# EAGLE design template (EAGLE 7.7.0)
DRAWING_NUMBER: V001; DRAWN: Mario Blunk / Blunk electronic; PROJECT: agile HW demo; STATUS: development

## Sheet 1 of 2
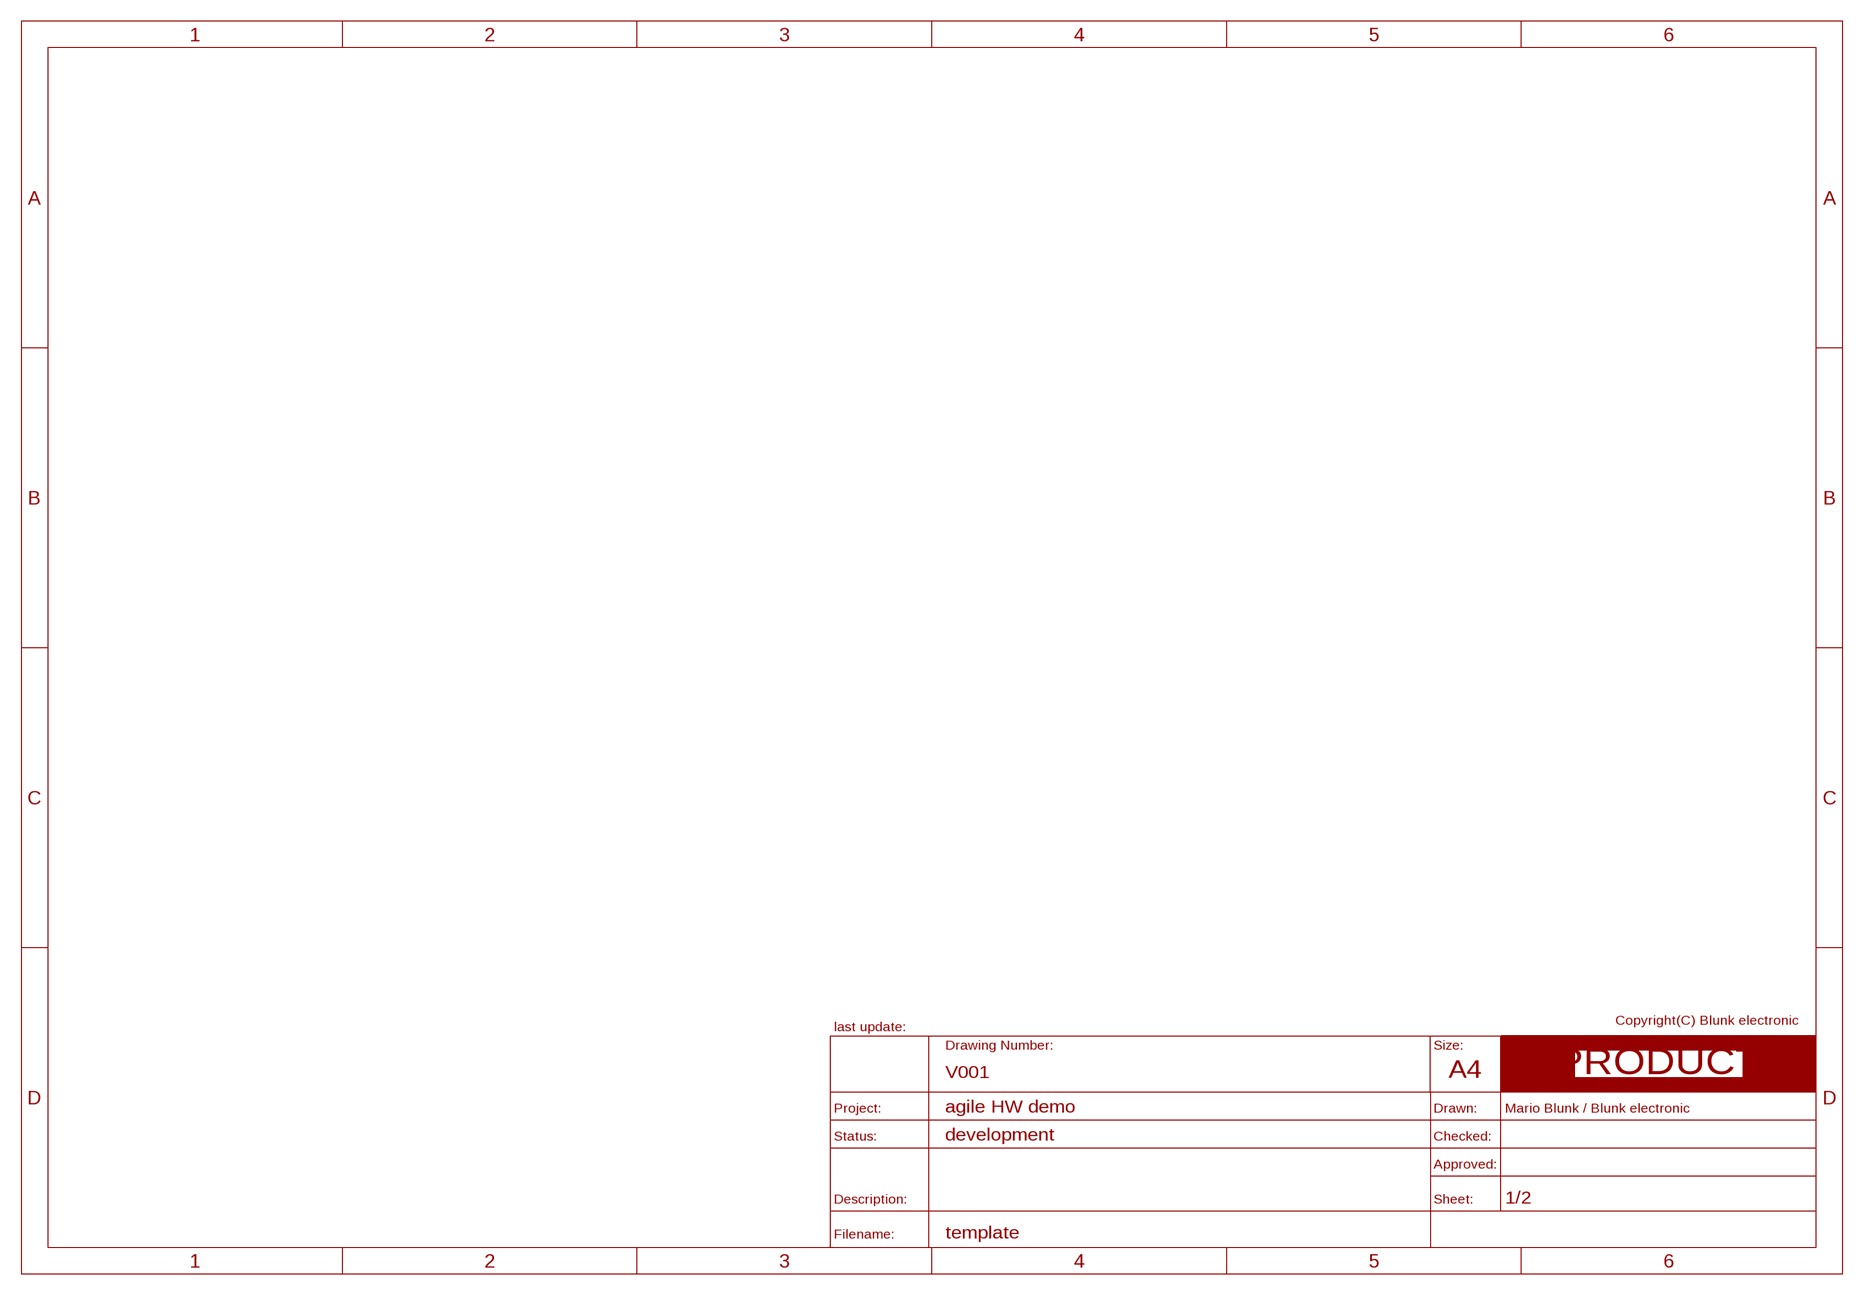
[diagram p0: schematic, sheet 1]
FRAME_PRODUCT1 (A4_LANDSCAPE_PRODUCT): BOM: NO; COMMISSIONED: 2013-08-30

## Sheet 2 of 2
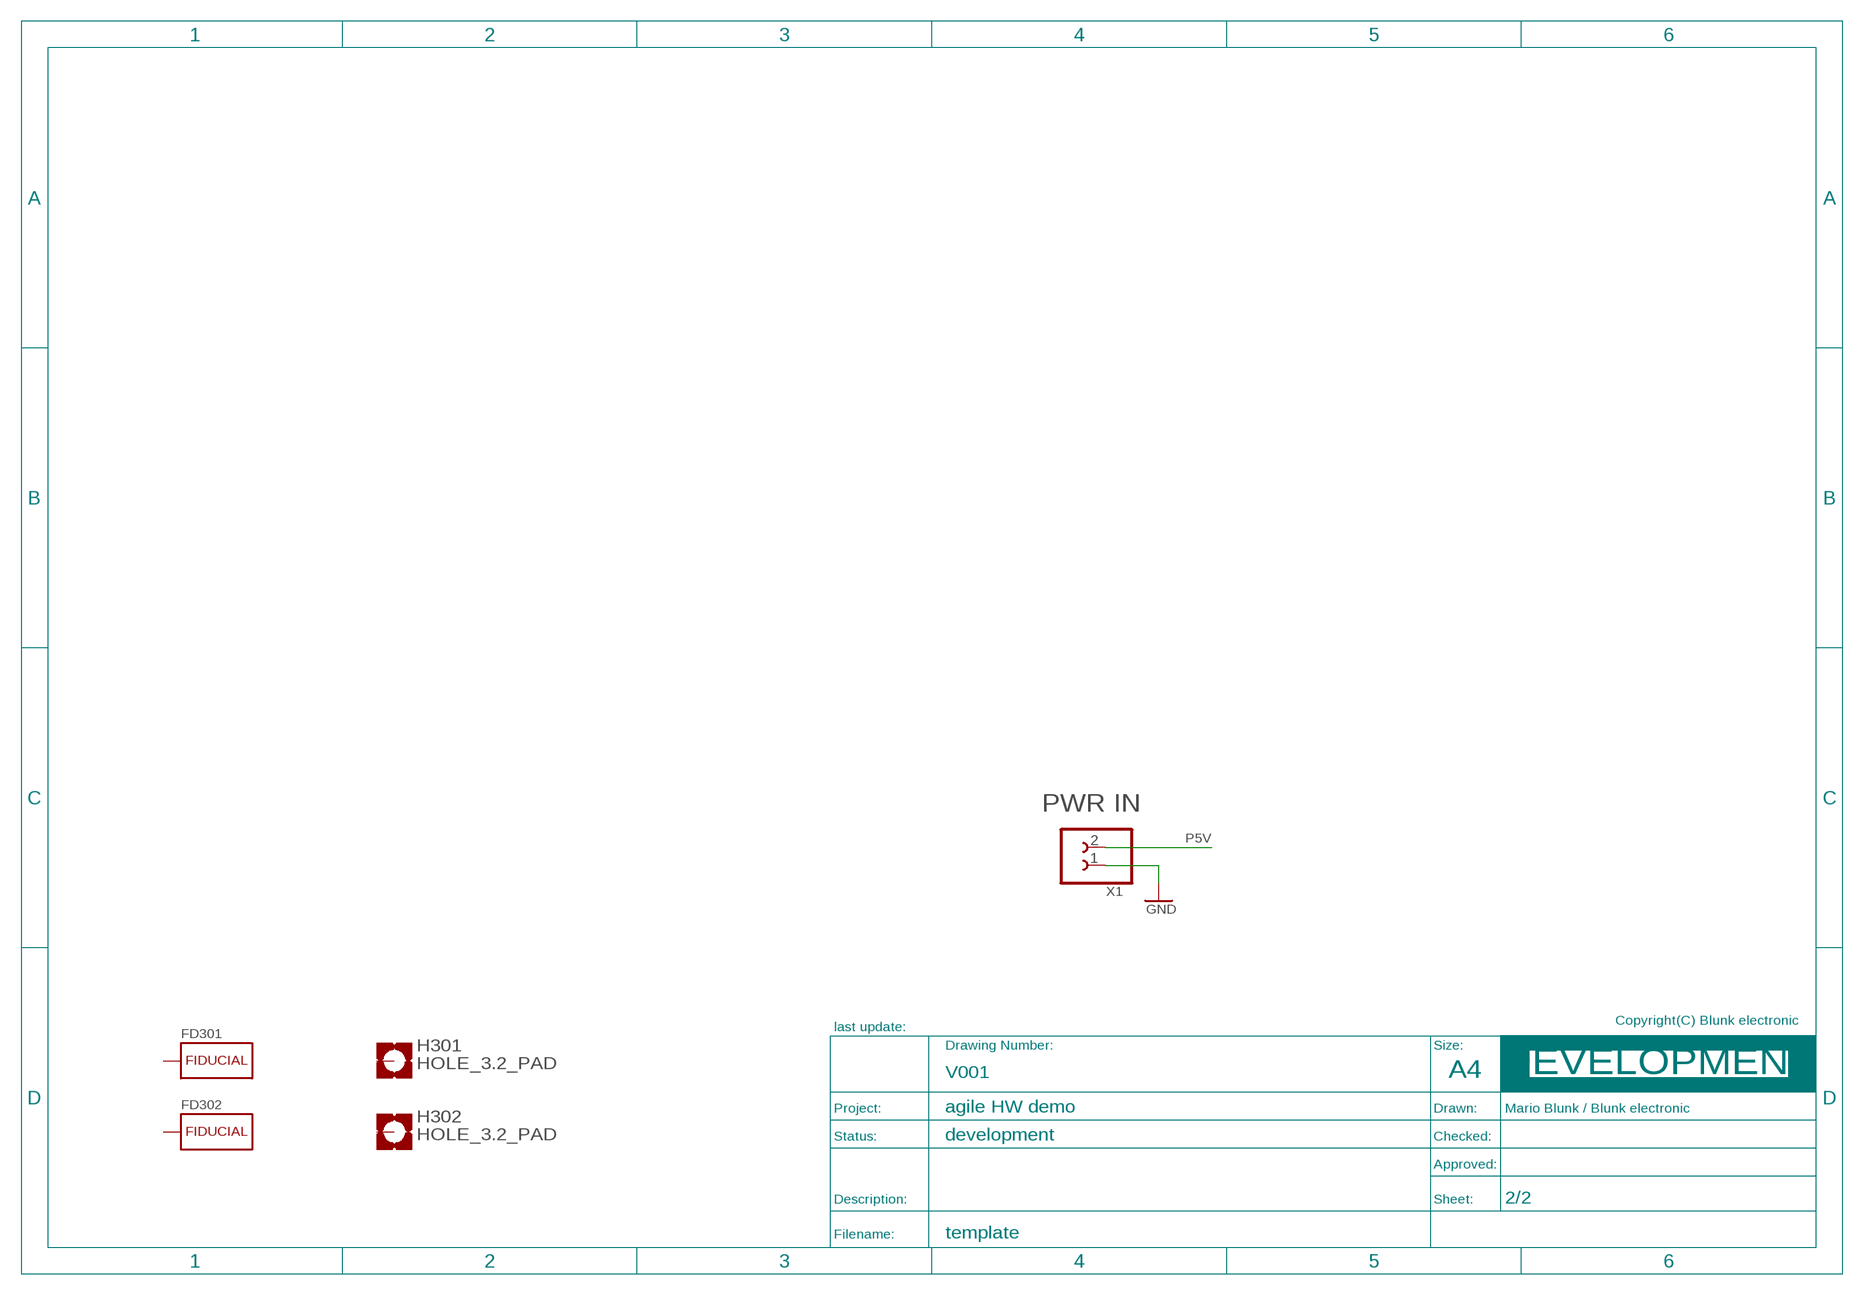
[diagram p1: schematic, sheet 2]
FRAME_DEVELOPMENT1 (A4_LANDSCAPE_DEVELOPMENT): BOM: NO; COMMISSIONED: 2013-08-30

### Parts
FD301  FIDUCIAL_CROSSHAIR  [CROSSHAIR]
FD302  FIDUCIAL_CROSSHAIR  [CROSSHAIR]
H301  HOLE_3.2_PAD  [3.2_PAD]
H302  HOLE_3.2_PAD  [3.2_PAD]
X1  CLAMP_1X2-T-2.5MM  [T_WIRE_CLAMP_1X2_PITCH_2MM5]

### Nets
GND: X1.1
P5V: X1.2
Unconnected: FD301.1(NC) FD302.1(NC) H301.H1(MOUNT) H302.H1(MOUNT)

## Library data of the parts
FD301 FD302 = be_marks:FIDUCIAL: drawn: Mario Blunk / Blunk electronic; BOM: NO; COMMISSIONED: 2013-12-03
H301 H302 = be_holes:HOLE: edited: Mario Blunk; BOM: NO; COMMISSIONED: 2015-01-15
X1 = be_con_jump:CLAMP_1X2: drawn: Mario Blunk / Blunk electronic; BOM: YES; COMMISSIONED: 2014-04-14; FUNCTION: PWR IN; PART_CODE_BEL: X_PAC_T_CLAMP_1X2_PITCH_2mm5

## Board
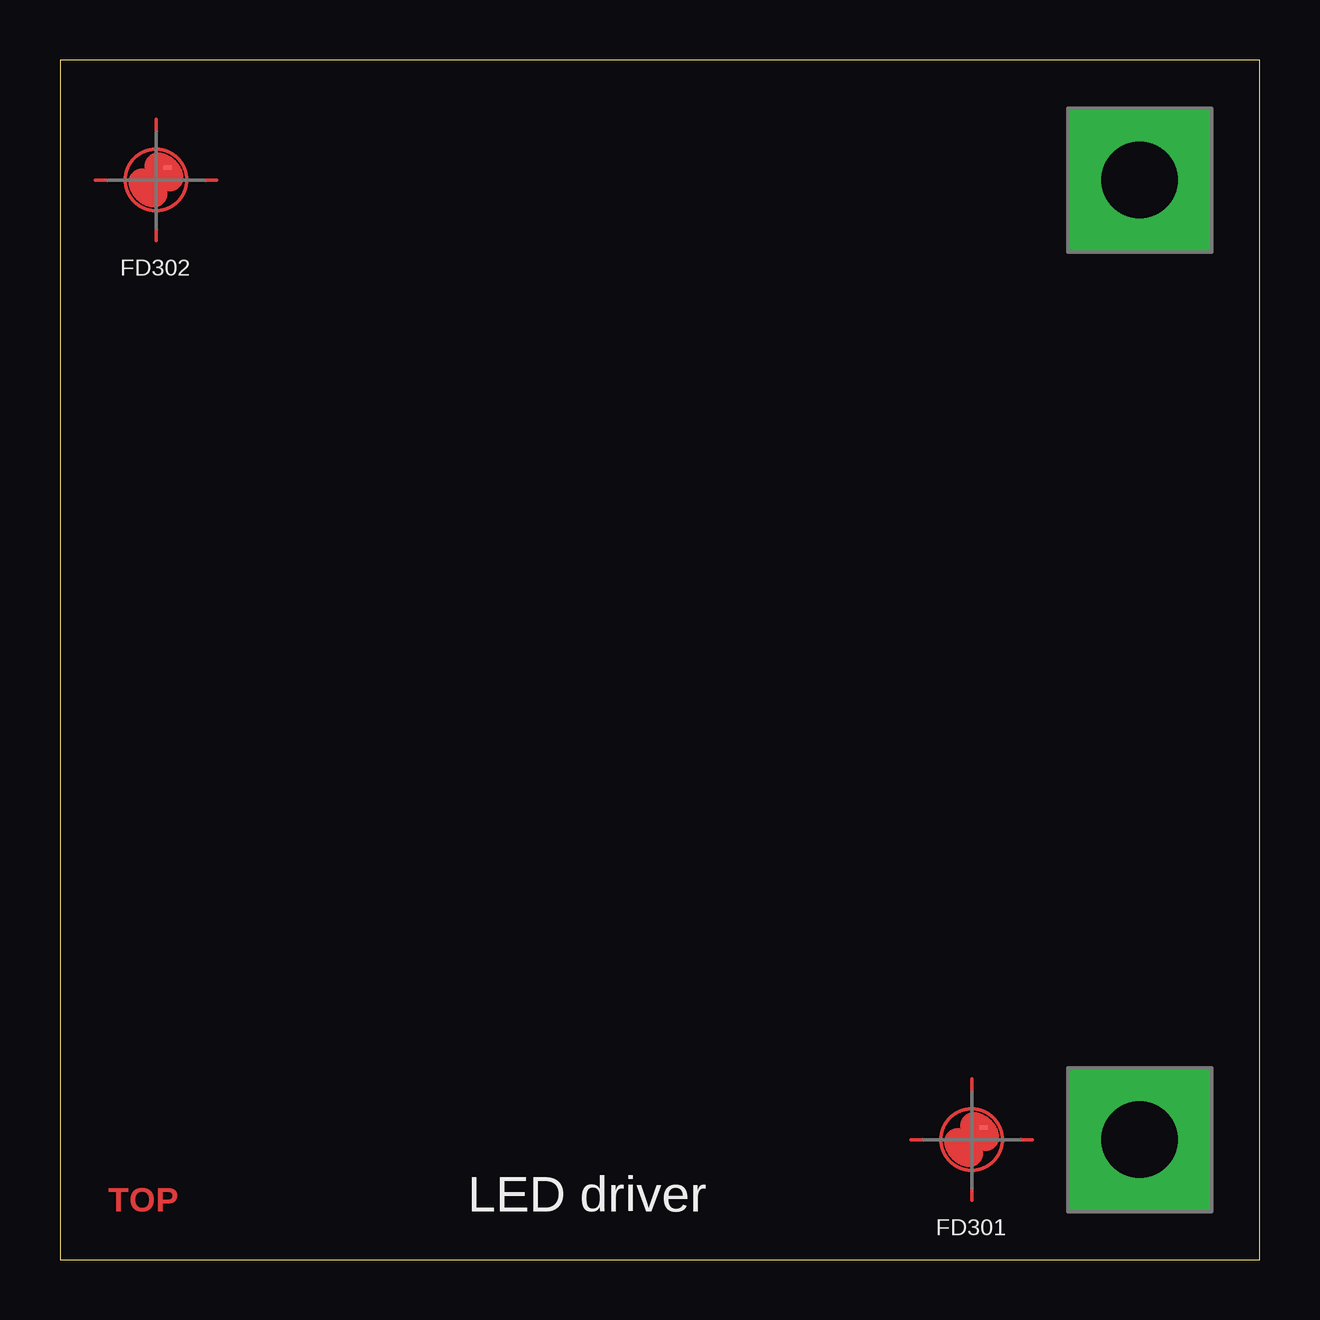
[diagram p2: board, top side]
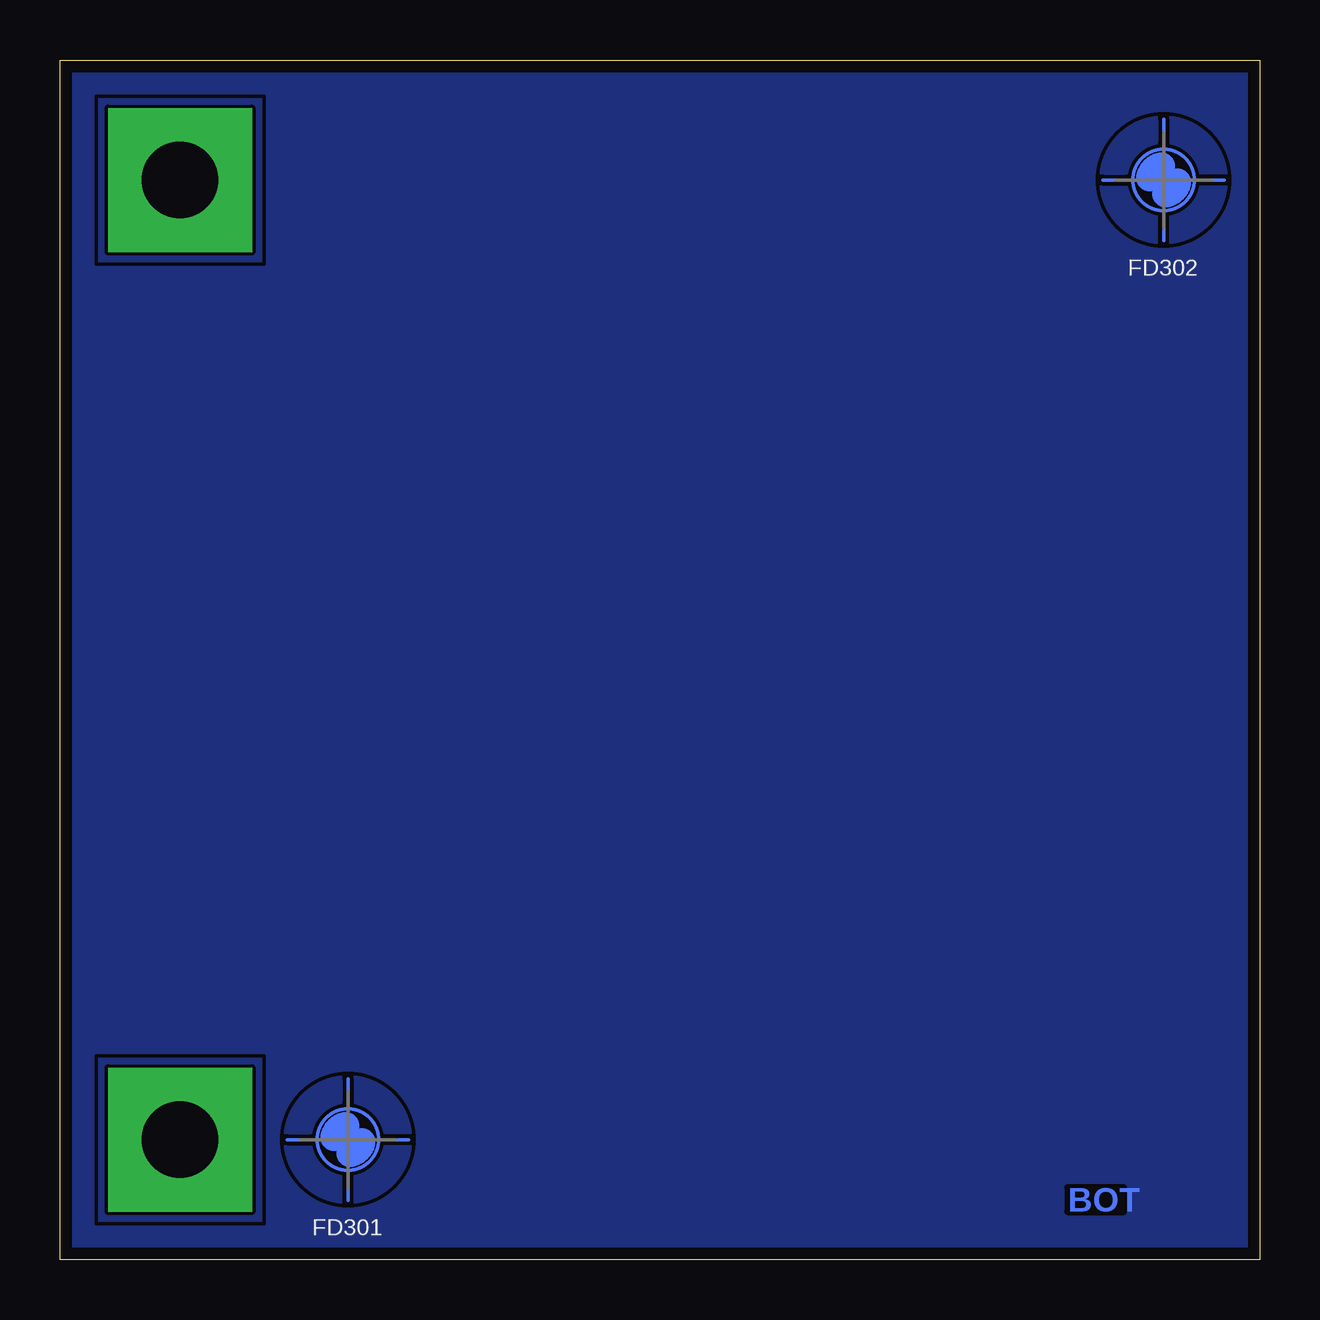
[diagram p3: board, bottom side, seen from below]

Size 50 x 50 mm. Coordinates in mm from the lower left corner, seen from the top.
Outline: 0,0 50,0 50,50 0,50 0,0
Copper layers (1+2*15+16): Top 0.018mm / dielectric 0.37mm / Route2 0.035mm / dielectric 0.65mm / Route15 0.035mm / dielectric 0.37mm / Bottom 0.018mm
Design rules "JLP_ML4_std": minimum track width 0.15mm, minimum drill 0.3mm, track to track 0.15mm, track to pad 0.15mm, pad to pad 0.15mm, via to via 0.15mm, smd to smd 0.15mm, copper to edge 0.5mm, drill to drill 0.2mm, minimum pad ring 0.15mm, minimum via ring 0.15mm, stop-mask expansion 0.075mm, vias tented up to drill 0.3mm, thermal gap 0.2mm

### Footprints (pad centres in the part's own frame; a part is rotated, then mirrored left to right if it is on the bottom)
CROSSHAIR = smd 0.305 x 0.152: 1 0.5,0.5
3.2_PAD = drill 3.2 pad 6 square: H1 0,0
T_WIRE_CLAMP_1X2_PITCH_2MM5 = drill 1.3 pad 1.8 long: 1 -1.25,-0.02; 2 1.25,-0.02

### Placement (x,y rotation side)
FD301  38,5 0 top
FD302  4,45 0 top
H301  45,45 0 top
H302  45,5 0 top
U$5  [A4_LANDSCAPE]  -165,-46 0 top  (outside the outline)
X1  -155,-56 0 top  (outside the outline)

### Tracks (layer width: path | path; a pad name or v marks a point on that pad's centre or on a via)
GND
  pour Bottom: 0,50 50,50 50,0 0,0

### Text on the board
Top: TOP
Bottom: BOT
tPlace: LED driver